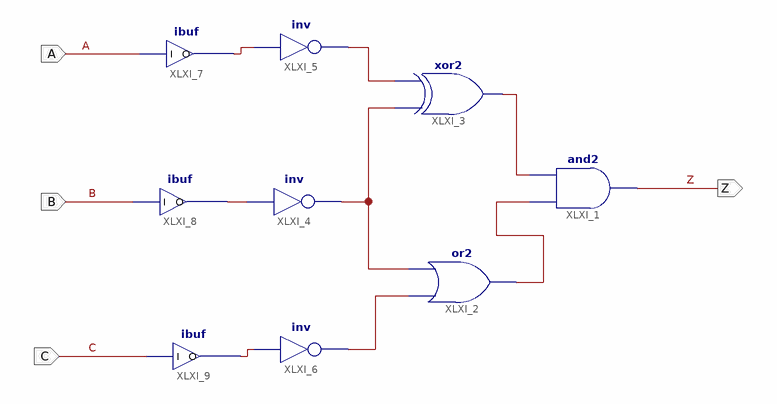
[diagram p0: schematic sheet 1]
// Xilinx ISE schematic Section2_Schematic.sch (xc9500xl) as structural Verilog: 9 symbols, 4 ports
module Section2_Schematic (
  input  A,
  input  B,
  input  C,
  output Z
);

  wire XLXN_1, XLXN_2, XLXN_3, XLXN_4, XLXN_6, XLXN_7, XLXN_9, XLXN_10;

  and XLXI_1 (Z, XLXN_9, XLXN_10);
  or XLXI_2 (XLXN_9, XLXN_6, XLXN_4);
  xor XLXI_3 (XLXN_10, XLXN_4, XLXN_2);
  not XLXI_4 (XLXN_4, XLXN_3);
  not XLXI_5 (XLXN_2, XLXN_1);
  not XLXI_6 (XLXN_6, XLXN_7);
  ibuf XLXI_7 (.I(A), .O(XLXN_1));
  ibuf XLXI_8 (.I(B), .O(XLXN_3));
  ibuf XLXI_9 (.I(C), .O(XLXN_7));
endmodule
